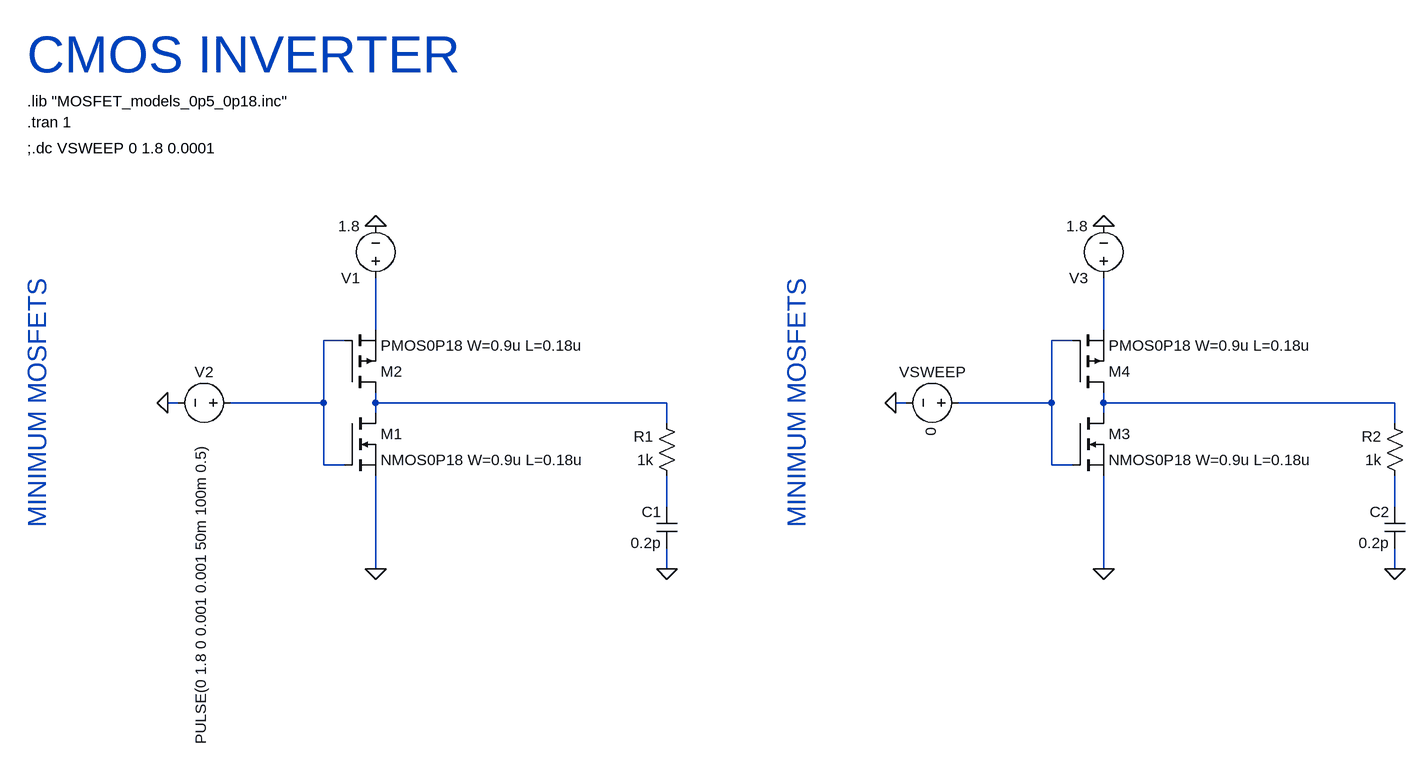
[diagram p0: schematic CMOS_INV_Minimum_0_18u.asc]
CMOS_INV_Minimum_0_18u.asc, the LTspice schematic file:
Version 4
SHEET 1 1700 1640
WIRE -880 -224 -880 -304
WIRE 240 -224 240 -304
WIRE -928 -208 -960 -208
WIRE 192 -208 160 -208
WIRE -1184 -112 -1200 -112
WIRE -960 -112 -960 -208
WIRE -960 -112 -1104 -112
WIRE -880 -112 -880 -128
WIRE -432 -112 -880 -112
WIRE -64 -112 -80 -112
WIRE 160 -112 160 -208
WIRE 160 -112 16 -112
WIRE 240 -112 240 -128
WIRE 688 -112 240 -112
WIRE -880 -96 -880 -112
WIRE 240 -96 240 -112
WIRE -432 -80 -432 -112
WIRE 688 -80 688 -112
WIRE -960 -16 -960 -112
WIRE -928 -16 -960 -16
WIRE 160 -16 160 -112
WIRE 192 -16 160 -16
WIRE -432 48 -432 0
WIRE 688 48 688 0
WIRE -880 144 -880 0
WIRE -432 144 -432 112
WIRE 240 144 240 0
WIRE 688 144 688 112
FLAG -880 144 0
FLAG -880 -384 0
FLAG -1200 -112 0
FLAG -432 144 0
FLAG 240 144 0
FLAG 240 -384 0
FLAG -80 -112 0
FLAG 688 144 0
SYMBOL nmos -928 -96 R0
SYMATTR InstName M1
SYMATTR Value NMOS0P18 W=0.9u L=0.18u
SYMBOL pmos -928 -128 M180
SYMATTR InstName M2
SYMATTR Value PMOS0P18 W=0.9u L=0.18u
SYMBOL voltage -880 -288 R180
WINDOW 123 0 0 Left 0
WINDOW 39 0 0 Left 0
SYMATTR InstName V1
SYMATTR Value 1.8
SYMBOL voltage -1088 -112 R90
WINDOW 0 -32 56 VBottom 2
WINDOW 3 293 45 Top 2
WINDOW 123 0 0 Left 0
WINDOW 39 0 0 Left 0
SYMATTR InstName V2
SYMATTR Value PULSE(0 1.8 0 0.001 0.001 50m 100m 0.5)
SYMBOL res -416 16 R180
WINDOW 0 36 76 Left 2
WINDOW 3 36 40 Left 2
SYMATTR InstName R1
SYMATTR Value 1k
SYMBOL cap -416 112 R180
WINDOW 0 24 56 Left 2
WINDOW 3 24 8 Left 2
SYMATTR InstName C1
SYMATTR Value 0.2p
SYMBOL nmos 192 -96 R0
SYMATTR InstName M3
SYMATTR Value NMOS0P18 W=0.9u L=0.18u
SYMBOL pmos 192 -128 M180
SYMATTR InstName M4
SYMATTR Value PMOS0P18 W=0.9u L=0.18u
SYMBOL voltage 240 -288 R180
WINDOW 123 0 0 Left 0
WINDOW 39 0 0 Left 0
SYMATTR InstName V3
SYMATTR Value 1.8
SYMBOL voltage 32 -112 R90
WINDOW 0 -32 56 VBottom 2
WINDOW 3 45 42 Top 2
WINDOW 123 0 0 Left 0
WINDOW 39 0 0 Left 0
SYMATTR InstName VSWEEP
SYMATTR Value 0
SYMBOL res 704 16 R180
WINDOW 0 36 76 Left 2
WINDOW 3 36 40 Left 2
SYMATTR InstName R2
SYMATTR Value 1k
SYMBOL cap 704 112 R180
WINDOW 0 24 56 Left 2
WINDOW 3 24 8 Left 2
SYMATTR InstName C2
SYMATTR Value 0.2p
TEXT -1416 -576 Left 2 !.lib "MOSFET_models_0p5_0p18.inc"
TEXT -1416 -544 Left 2 !.tran 1
TEXT -1416 -504 Left 2 !;.dc VSWEEP 0 1.8 0.0001
TEXT -1400 80 VLeft 4 ;MINIMUM MOSFETS
TEXT -1416 -648 Left 6 ;CMOS INVERTER
TEXT -232 80 VLeft 4 ;MINIMUM MOSFETS

The netlist it stands for:
* CMOS_INV_Minimum_0_18u.asc
M1 N005 N003 0 0 NMOS0P18 W=0.9u L=0.18u
M2 N005 N003 N001 N001 PMOS0P18 W=0.9u L=0.18u
V1 N001 0 1.8
V2 N003 0 PULSE(0 1.8 0 0.001 0.001 50m 100m 0.5)
R1 N007 N005 1k
C1 0 N007 0.2p
M3 N006 N004 0 0 NMOS0P18 W=0.9u L=0.18u
M4 N006 N004 N002 N002 PMOS0P18 W=0.9u L=0.18u
V3 N002 0 1.8
VSWEEP N004 0 0
R2 N008 N006 1k
C2 0 N008 0.2p
.model NMOS NMOS
.model PMOS PMOS
.lib standard.mos
.lib "MOSFET_models_0p5_0p18.inc"
.tran 1
;.dc VSWEEP 0 1.8 0.0001
* MINIMUM MOSFETS
* CMOS INVERTER
* MINIMUM MOSFETS
.backanno
.end